# EAGLE design LipSync4_Main_Board_Alpha2 (EAGLE 9.6.2)
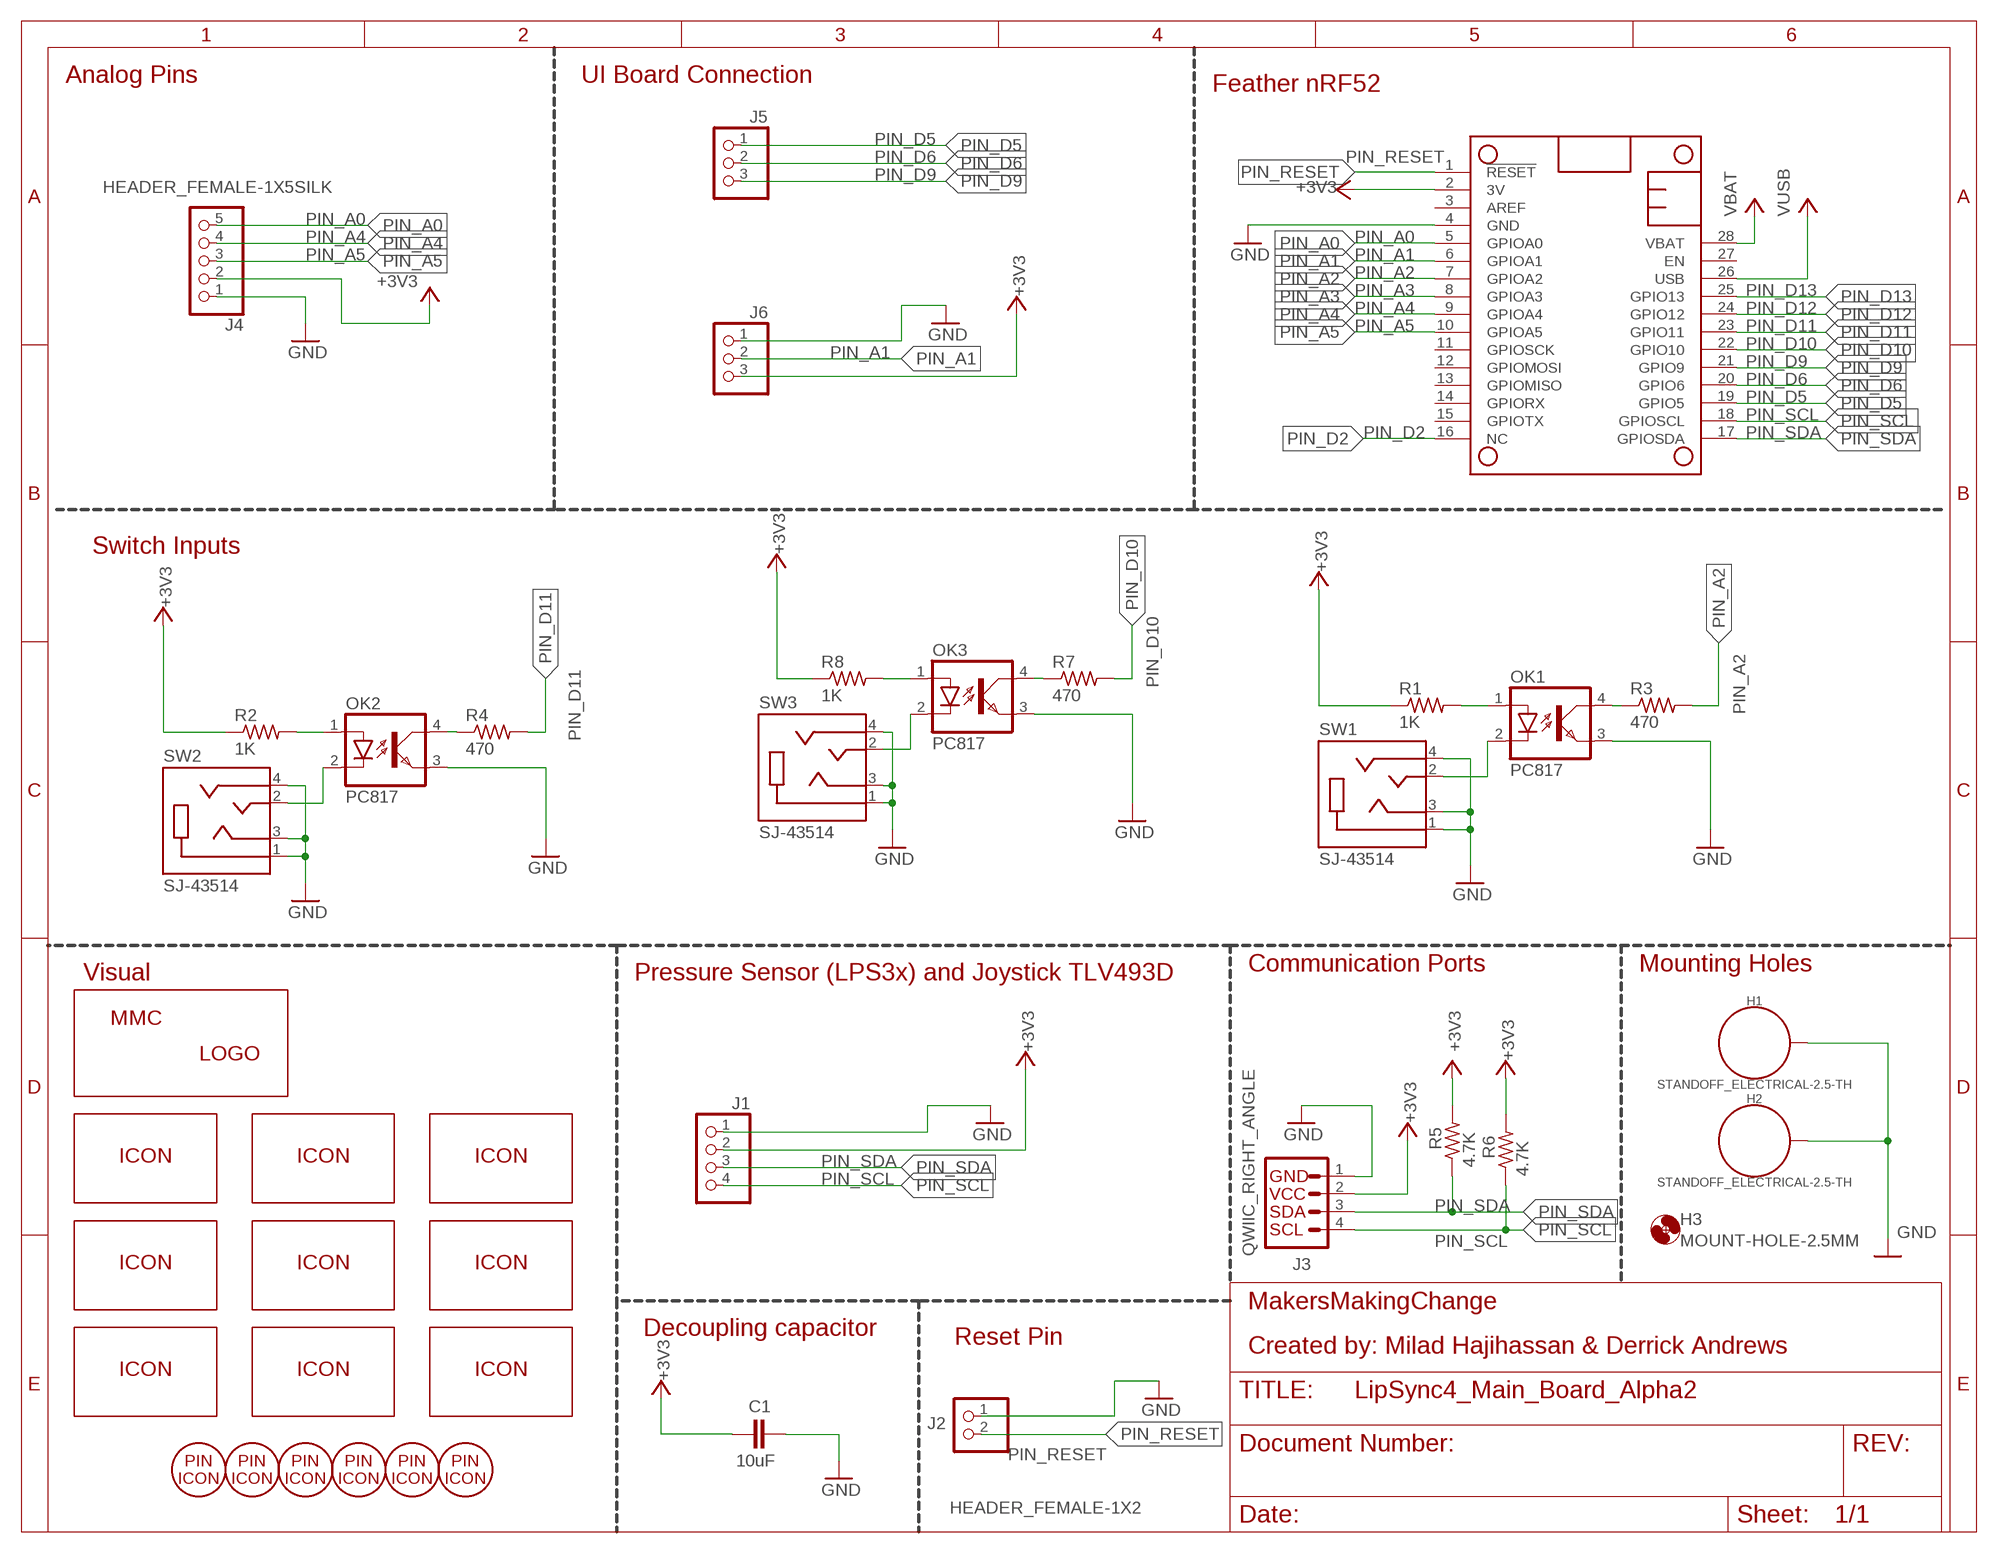
[diagram p0: schematic, sheet 1]

## Parts
C1  10uF  CAPACITOR-025-025X040  [CAP-025-025X040]
H1  STANDOFF_ELECTRICAL-2.5-TH  [STANDOFF-ELECTRICAL-2.5-TH]
H2  STANDOFF_ELECTRICAL-2.5-TH  [STANDOFF-ELECTRICAL-2.5-TH]
H3  MOUNT-HOLE-2.5MM  [HOLE-2.5MM]
J1  HEADER_FEMALE-1X4  [HEADER_FEMALE-1X04]
J2  HEADER_FEMALE-1X2  [HEADER_FEMALE-1X02]
J3  QWIIC_RIGHT_ANGLE  QWIIC_CONNECTORSJS-1MM  [CONNECTORS_JST04_1MM_RA]
J4  HEADER_FEMALE-1X5SILK  [HEADER_FEMALE-1X05_SILK]
J5  HEADER_MALE-1X03/270  [HEADER_MALE-1X03_LOCK/270]
J6  HEADER_MALE-1X03/270  [HEADER_MALE-1X03_LOCK/270]
LABE_BUTTON  MMC_ICON-BUTTON  [ICON_BUTTON]
LABE_LED  MMC_ICON-LED  [ICON_LED]
LABEL_ALPHA2  MMC_ICON-ALPHA2  [ICON_ALPHA2]
LABEL_I2C  MMC_ICON-I2C  [ICON_I2C]
LABEL_ICON_PIN1  MMC_PIN-ICON-PIN1  [PIN-ICON_1]
LABEL_ICON_PIN2  MMC_PIN-ICON-PIN2  [PIN-ICON_2]
LABEL_ICON_PIN3  MMC_PIN-ICON-PIN3  [PIN-ICON_3]
LABEL_ICON_PIN-DATA  MMC_PIN-ICON-DATA  [PIN-ICON_DATA]
LABEL_ICON_PIN-GND  MMC_PIN-ICON-GND  [PIN-ICON_GND]
LABEL_ICON_PIN-VCC  MMC_PIN-ICON-VCC  [PIN-ICON_VCC]
LABEL_LIPSYNC4  MMC_ICON-LIPSYNC4  [ICON_LIPSYNC4]
LABEL_MAIN-BOARD  MMC_ICON-MAIN-BOARD  [ICON_MAIN-BOARD]
LABEL_MMC  MMC_LOGO-SM  [MMC_SMALL_LOGO]
LABEL_RESET  MMC_ICON-RESET  [ICON_RESET]
LABEL_SPEAKER  MMC_ICON-SPEAKER  [ICON_SPEAKER]
LABEL_STEMMA  MMC_ICON-STEMMA  [ICON_STEMMA]
OK1  PC817  [DIL04]
OK2  PC817  [DIL04]
OK3  PC817  [DIL04]
R1  1K  RESISTOR-US-0204/5  [RESISTOR_0204/5]
R2  1K  RESISTOR-US-0204/5  [RESISTOR_0204/5]
R3  470  RESISTOR-US-0204/5  [RESISTOR_0204/5]
R4  470  RESISTOR-US-0204/5  [RESISTOR_0204/5]
R5  4.7K  RESISTOR-US-0204/5  [RESISTOR_0204/5]
R6  4.7K  RESISTOR-US-0204/5  [RESISTOR_0204/5]
R7  470  RESISTOR-US-0204/5  [RESISTOR_0204/5]
R8  1K  RESISTOR-US-0204/5  [RESISTOR_0204/5]
SW1  SJ-43514  [CUI_SJ-43514]
SW2  SJ-43514  [CUI_SJ-43514]
SW3  SJ-43514  [CUI_SJ-43514]
U1  ADAFRUIT_FEATHER_NODIM  [ADAFRUIT_FEATHERWING_DIM]

## Nets
+3V3: C1.2 J1.2 J3.2 J4.2 J6.3 R1.1 R2.1 R5.2 R6.2 R8.1 U1.2(3V)
GND: C1.1 H1.P1 H2.P1 J1.1 J2.1 J3.1 J4.1 J6.1 OK1.3(EMIT) OK2.3(EMIT) OK3.3(EMIT) SW1.1(SLEEVE) SW1.3(RING1) SW1.4(RING2) SW2.1(SLEEVE) SW2.3(RING1) SW2.4(RING2) SW3.1(SLEEVE) SW3.3(RING1) SW3.4(RING2) U1.4(GND)
N$1: OK3.1(A) R8.2
N$2: OK3.4(COL) R7.1
N$5: OK3.2(C) SW3.2(TIP)
N$7: OK2.1(A) R2.2
N$13: OK2.4(COL) R4.1
N$14: OK1.1(A) R1.2
N$16: OK2.2(C) SW2.2(TIP)
N$20: OK1.4(COL) R3.1
N$23: OK1.2(C) SW1.2(TIP)
PIN_A0: J4.5 U1.5(GPIOA0)
PIN_A1: J6.2 U1.6(GPIOA1)
PIN_A2: R3.2 U1.7(GPIOA2)
PIN_A3: U1.8(GPIOA3)
PIN_A4: J4.4 U1.9(GPIOA4)
PIN_A5: J4.3 U1.10(GPIOA5)
PIN_D2: U1.16(NC)
PIN_D5: J5.1 U1.19(GPIO5)
PIN_D6: J5.2 U1.20(GPIO6)
PIN_D9: J5.3 U1.21(GPIO9)
PIN_D10: R7.2 U1.22(GPIO10)
PIN_D11: R4.2 U1.23(GPIO11)
PIN_D12: U1.24(GPIO12)
PIN_D13: U1.25(GPIO13)
PIN_RESET: J2.2 U1.1(!RESET)
PIN_SCL: J1.4 J3.4 R6.1 U1.18(GPIOSCL)
PIN_SDA: J1.3 J3.3 R5.1 U1.17(GPIOSDA)
VBAT: U1.28(VBAT)
VUSB: U1.26(USB)
Unconnected: U1.3(AREF) U1.11(GPIOSCK) U1.12(GPIOMOSI) U1.13(GPIOMISO) U1.14(GPIORX) U1.15(GPIOTX) U1.27(EN)

## Notes on the sheet
- Analog Pins | UI Board Connection
- Feather nRF52
- Switch Inputs
- Communication Ports | Mounting Holes
- Visual | Pressure Sensor (LPS3x) and Joystick TLV493D
- MakersMakingChange
- Decoupling capacitor
- Reset Pin
- Created by: Milad Hajihassan & Derrick Andrews

## Library data of the parts
C1 = MMC Eagle:CAPACITOR-
H1 H2 = MMC Eagle:STANDOFF_ELECTRICAL: Stand Off Drill holes with an electrical connection. For example, use these to ground your board to a chassis. Example SparkFun Products Screw - Phillips Head (1/4", 4-40, 10 pack) <https://www.sparkfun.com/products/10453> (PRT-10453) Screw - Phillips Head (1/2", 4-40, 10 pack) <https://www.sparkfun.com/products/10452> (PRT-10452) Screw - Phillips Head (3/4", 4-40, 10 pack) <https://www.sparkfun.com/products/10451> (PRT-10451) Screw - Phillips Head (1", 4-40, 10 pack) <https://www.sparkfun.com/products/10450> (PRT-10450)
H3 = MMC Eagle:MOUNT-HOLE-: MOUNTING HOLE with drill center marker
J1 = MMC Eagle:HEADER_FEMALE-1X4: PIN HEADER
J2 = MMC Eagle:HEADER_FEMALE-1X2
J3 = MMC_SMD:QWIIC_CONNECTORS: SparkFun I2C Standard Qwiic Connector An SMD 1mm pitch JST connector makes it easy and quick (get it? Qwiic?) to connect I2C devices to each other. The Qwiic system <http://www.sparkfun.com/qwiic> enables fast and solderless connection between popular platforms and various sensors and actuators. We carry 200mm <https://www.sparkfun.com/products/14204>, 100mm <https://www.sparkfun.com/products/14205>, 50mm <https://www.sparkfun.com/products/14206>, and breadboard friendly <https://www.sparkfun.com/products/14207> Qwiic cables. We also offer 10 pcs strips <https://www.sparkfun.com/products/14323> the SMD connectors.; PROD_ID: CONN-13694
J4 = MMC Eagle:HEADER_FEMALE-1X5
J5 J6 = MMC Eagle:HEADER_MALE-1X03: Multi connection point. Often used as Generic Header-pin footprint for 0.1 inch spaced/style header connections On any of the 0.1 inch spaced packages, you can populate with these: Break Away Headers - Straight <https://www.sparkfun.com/products/116> (PRT-00116) Break Away Male Headers - Right Angle <https://www.sparkfun.com/products/553> (PRT-00553) Female Headers <https://www.sparkfun.com/products/115> (PRT-00115) Break Away Headers - Machine Pin <https://www.sparkfun.com/products/117> (PRT-00117) Break Away Female Headers - Swiss Machine Pin <https://www.sparkfun.com/products/743> (PRT-00743) Stackable Header - 3 Pin (Female, 0.1") <https://www.sparkfun.com/products/13875> (PRT-13875) For SCREWTERMINALS and SPRING TERMINALS visit here: Screw Terimnals on SparkFun.com <https://www.sparkfun.com/search/results?term=Screw+Terminals> (5mm/3.5mm/2.54mm spacing) This device is also useful as a general connection point to wire up your design to another part of your project. Our various solder wires solder well into these plated through hole pads. Hook-Up Wire - Assortment (Stranded, 22 AWG) <https://www.sparkfun.com/products/11375> (PRT-11375) Hook-Up Wire - Assortment (Solid Core, 22 AWG) <https://www.sparkfun.com/products/11367> (PRT-11367) View the entire wire category on our website here <https://www.sparkfun.com/categories/141> Special notes: Molex polarized connector foot print use with SKU : PRT-08232 with associated crimp pins and housings.
LABE_BUTTON LABE_LED LABEL_ALPHA2 LABEL_I2C LABEL_LIPSYNC4 LABEL_MAIN-BOARD LABEL_RESET LABEL_SPEAKER LABEL_STEMMA = MMC Eagle:MMC_ICON-
LABEL_ICON_PIN1-LABEL_ICON_PIN3 LABEL_ICON_PIN-DATA LABEL_ICON_PIN-GND LABEL_ICON_PIN-VCC = MMC Eagle:MMC_PIN-ICON-
LABEL_MMC = MMC Eagle:MMC_LOGO-
OK1-OK3 = MMC Eagle:PC817: SHARP OPTO COUPLER
R1-R8 = MMC Eagle:RESISTOR-US-: RESISTOR, American symbol
SW1-SW3 = MMC Eagle:SJ-43514: SJ-43514 3.50mm (0.141", 1/8", Mini Plug) - Headphone Phone Jack Stereo (4 Conductor, TRRS) Connector. You can use these as jacks to connect analog joysticks or create simple switch interfaces. Options: Digikey - CP-43514-ND <https://www.digikey.ca/en/products/detail/cui-devices/SJ-43514/368146> Mouser - 490-SJ-43514 <https://www.mouser.ca/ProductDetail/CUI-Devices/SJ-43514?qs=WyjlAZoYn51bsBOfuwwiuw%3D%3D>
U1 = MMC Eagle:ADAFRUIT_FEATHER: Adafruit Feather Feather is a flexible and powerful family of microcontroller main-boards (Feathers​) and daughter-boards (Wings) with a wide range of capabilities. Options: Adafruit - Adafruit Feather Boards <https://www.adafruit.com/category/830> Adafruit - Adafruit Feather Wings <https://www.adafruit.com/category/871>

## Board
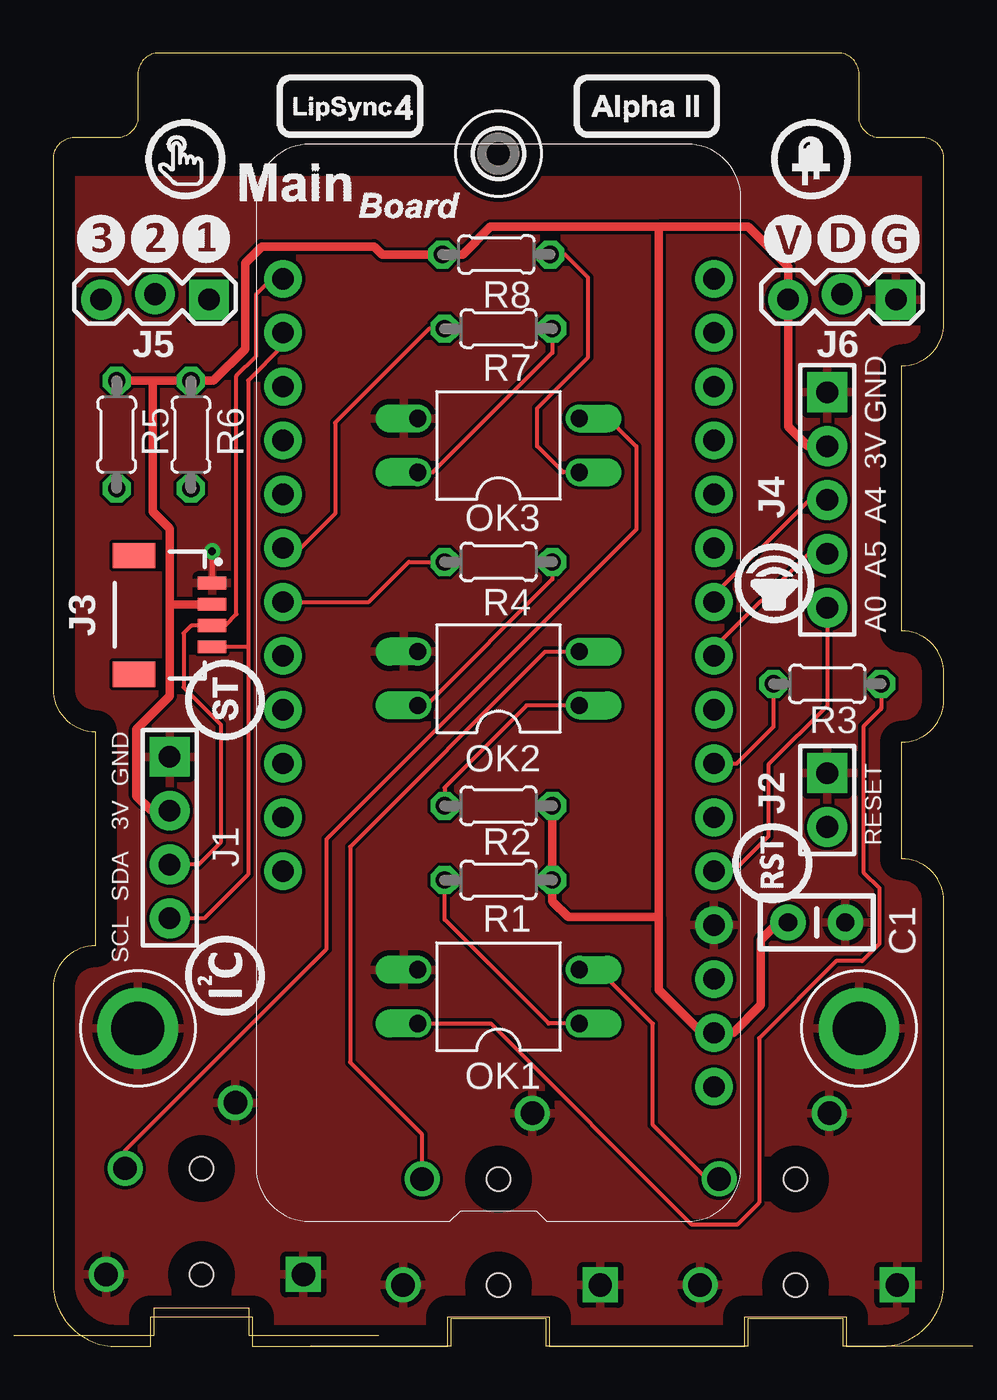
[diagram p1: board, top side]
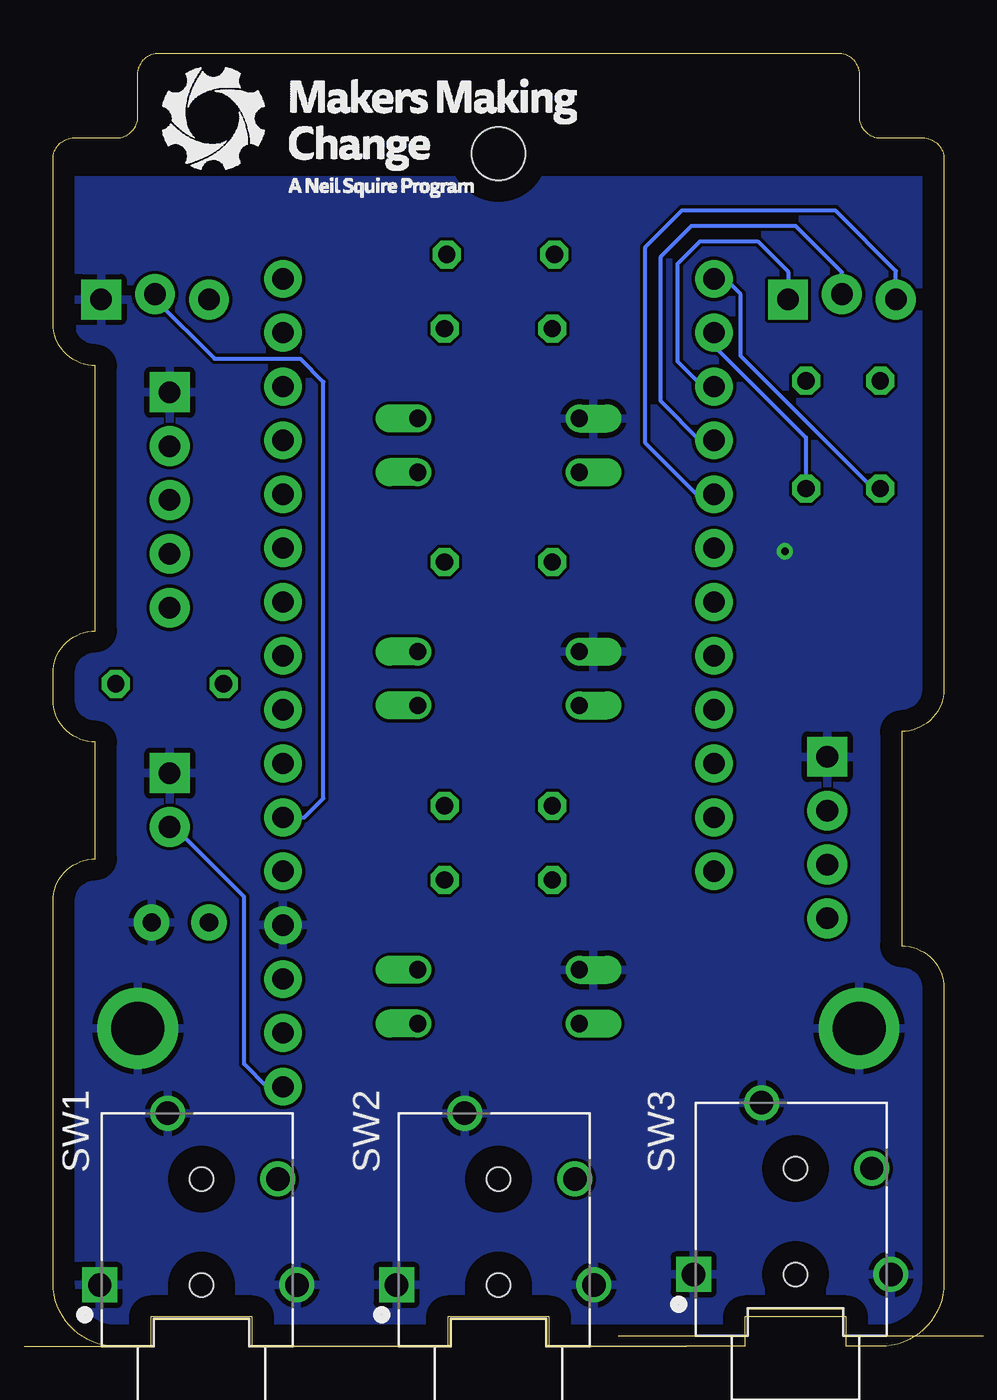
[diagram p2: board, bottom side, seen from below]

Size 42 x 61 mm. Coordinates in mm from the lower left corner, seen from the top.
Outline: 3,0 4.6,0 4.6,1.4 9.4,1.4 9.4,0 18.6,0 18.6,1.4 23.4,1.4 23.4,0 32.6,0 32.6,1.4 37.4,1.4 37.4,0 39,0 arc90 42,3 42,21 arc90 40,23 40,28.5 arc90 42,30.5 42,31.75 arc90 40,33.75 40,46.25 arc90 42,48.25 42,56 arc90 41,57 39,57 arc-90 38,58 38,60 arc90 37,61 5,61 arc90 4,60 4,58 arc-90 3,57 1,57 arc90 0,56 0,31 arc90 2,29 2,18.9 arc90 0,16.9 0,3 arc90 3,0
Copper layers (1*16): Top 0.035mm / dielectric 1.5mm / Bottom 0.035mm
Design rules "default": minimum track width 6mil, minimum drill 0.35mm, track to track 6mil, track to pad 6mil, pad to pad 6mil, via to via 6mil, smd to smd 6mil, copper to edge 40mil, drill to drill 6mil, minimum pad ring 10mil, minimum via ring 8mil, stop-mask expansion 4mil, vias tented up to drill 0mil, thermal gap 10mil

### Footprints (pad centres in the part's own frame; a part is rotated, then mirrored left to right if it is on the bottom)
CAP-025-025X040 = drill 0.864 pad 1.676: 1 -1.35,0; 2 1.35,0
STANDOFF-ELECTRICAL-2.5-TH = drill 2.5 pad 3.81: P1 0,0
HOLE-2.5MM = hole 2.5: 0,0
HEADER_FEMALE-1X04 = drill 1.016 pad 1.88 square: 1 -3.81,0 | drill 1.016 pad 1.88: 2 -1.27,0; 3 1.27,0; 4 3.81,0
HEADER_FEMALE-1X02 = drill 1.016 pad 1.88 square: 1 0,0 | drill 1.016 pad 1.88: 2 2.54,0
CONNECTORS_JST04_1MM_RA = smd 0.6 x 1.35: 1 -1.5,0; 2 -0.5,0; 3 0.5,0; 4 1.5,0 | smd 1.2 x 2: NC1 2.8,-3.675; NC2 -2.8,-3.675
HEADER_FEMALE-1X05_SILK = drill 1.016 pad 1.88 square: 1 0,0 | drill 1.016 pad 1.88: 2 2.54,0; 3 5.08,0; 4 7.62,0; 5 10.16,0
HEADER_MALE-1X03_LOCK/270 = drill 1.016 pad 1.88 square: 1 0,0.127 | drill 1.016 pad 1.88: 2 2.54,-0.127; 3 5.08,0.127
DIL04 = drill 0.813 offset: 1 -1.27,-3.81; 2 1.27,-3.81; 3 1.27,3.81; 4 -1.27,3.81
RESISTOR_0204/5 = drill 0.813 octagon: 1 -2.54,0; 2 2.54,0
CUI_SJ-43514 = drill 1.1 square: 1 -2.6,4.8 | drill 1.1: 2 2.4,-3.6; 3 5.5,1.6; 4 -2.6,-4.5 | hole 1.1: -2.6,0; 2.4,0
ADAFRUIT_FEATHERWING_DIM = drill 1 pad 1.778: 1 6.35,-10.16; 2 8.89,-10.16; 3 11.43,-10.16; 4 13.97,-10.16; 5 16.51,-10.16; 6 19.05,-10.16; 7 21.59,-10.16; 8 24.13,-10.16; 9 26.67,-10.16; 10 29.21,-10.16; 11 31.75,-10.16; 12 34.29,-10.16; 13 36.83,-10.16; 14 39.37,-10.16; 15 41.91,-10.16; 16 44.45,-10.16; 17 44.45,10.16; 18 41.91,10.16; 19 39.37,10.16; 20 36.83,10.16; 21 34.29,10.16; 22 31.75,10.16; 23 29.21,10.16; 24 26.67,10.16; 25 24.13,10.16; 26 21.59,10.16; 27 19.05,10.16; 28 16.51,10.16

### Placement (x,y rotation side)
C1  36,20 180 top
H1  4,15 90 top
H2  38,15 90 top
H3  21,56.25 0 top
J1  5.5,24 270 top
J2  36.5,27.04 270 top
J3  7.5,34.5 270 top
J4  36.5,45 270 top
J5  7.35,49.5 180 top
J6  39.73,49.5 180 top
LABE_BUTTON  6.25,56 0 top
LABE_LED  35.75,56 0 top
LABEL_ALPHA2  28,58.5 0 top
LABEL_I2C  8.1,17.5 90 top
LABEL_ICON_PIN1  7.24,52.25 0 top
LABEL_ICON_PIN2  4.81,52.25 0 top
LABEL_ICON_PIN3  2.27,52.25 0 top
LABEL_ICON_PIN-DATA  37.19,52.25 0 top
LABEL_ICON_PIN-GND  39.73,52.25 0 top
LABEL_ICON_PIN-VCC  34.65,52.25 0 top
LABEL_LIPSYNC4  14,58.5 0 top
LABEL_MAIN-BOARD  14,54.5 0 top
LABEL_MMC  25.8,57.25 0 bottom
LABEL_RESET  34,22.75 90 top
LABEL_SPEAKER  34,36 90 top
LABEL_STEMMA  8.1,30.5 90 top
OK1  21,16.5 90 top
OK2  21,31.5 90 top
OK3  21,42.5 90 top
R1  21,22 180 top
R2  21,25.5 180 top
R3  36.5,31.25 180 top
R4  21,37 180 top
R5  3,43 90 top
R6  6.5,43 90 top
R7  21,48 180 top
R8  20.9,51.5 0 top
SW1  35,5.5 90 bottom
SW2  21,5.5 90 bottom
SW3  7,6 90 bottom
U1  21,5.9 90 top

### Tracks (layer width: path | path; a pad name or v marks a point on that pad's centre or on a via)
+3V3
  Top 0.406: 28.55,20.25 28.55,16.82 30.57,14.79 U1.2 32.06,14.79 33.38,16.1 33.38,19.18 34.2,20 C1.2 | 28.55,20.25 24.29,20.25 23.54,21 R1.1 R2.1 | 28.55,52.8 20.61,52.8 19.31,51.5 R8.1 15.51,51.5 15.13,51.88 9.84,51.88 9.05,51.09 9.05,47.04 7.55,45.54 R6.2 4.69,45.54 | 28.55,20.25 28.55,52.8 | 4.69,45.54 R5.2 | 4.69,45.54 4.69,39.37 5.5,38.56 5.5,34.99 | J3.2 5.51,35 5.5,34.99 | J1.2 4.63,25.27 3.93,25.97 3.93,29.1 5.5,30.67 5.5,34.99 | J4.2 35.58,42.46 34.65,43.39 J6.3 34.65,50.94 32.78,52.8 28.55,52.8
GND  (via drill 0.35)
  Top 0.254: J3.1 v7.5,37.5
  pour Bottom: 3,0 39,0 arc90 42,3 42,55 0,55 0,3 arc90
  pour Top: 3,0 39,0 arc90 42,3 42,55 0,55 0,3 arc90
N$1
  Top 0.2: OK3.1 24.04,41.23 22.82,42.45 22.82,44.25 25.23,46.66 25.23,50.41 24.14,51.5 R8.2
N$2
  Top 0.2: R7.1 23.54,46.86 17.91,41.23 OK3.4
N$5
  Top 0.2: SW3.2 3.4,9.25 12.9,18.75 12.9,23.93 27.5,38.53 27.5,42.45 26.18,43.77 OK3.2
N$7
  Top 0.2: OK2.1 22.33,30.23 18.46,26.36 R2.2
N$13
  Top 0.2: R4.1 23.54,36.19 17.59,30.23 OK2.4
N$14
  Top 0.2: OK1.1 23.36,15.23 18.46,20.13 R1.2
N$16
  Top 0.2: SW2.2 17.4,10 14,13.4 14,23.57 23.2,32.77 OK2.2
N$20
  Top 0.2: OK1.4 20.64,15.23 30.1,5.77 32.27,5.77 33.28,6.78 33.28,14.54 36.92,18.18 38.14,18.18 38.95,18.99 38.95,21.61 38.2,22.36 38.2,29.23 39.03,30.06 39.04,30.12 R3.1
N$23
  Top 0.2: OK1.2 25.73,17.77 28.28,15.22 28.28,10.44 30.82,7.9 SW1.2
PIN_A0
  Top 0.2: J4.5 36.5,30.21 33.73,27.44 33.73,24.06 32.07,22.41 U1.5
PIN_A1
  Bottom 0.2: U1.6 30.16,24.95 29.26,25.85 29.26,45.49 30.35,46.58 34.39,46.58 37.19,49.38 J6.2
PIN_A2
  Top 0.2: U1.7 32.22,27.49 33.96,29.23 R3.2
PIN_A4
  Top 0.2: J4.4 35.61,37.38 31.16,32.93 U1.9
PIN_A5
  Top 0.2: U1.10 31.16,35.43 35.65,39.92 J4.3
PIN_D5
  Bottom 0.2: U1.19 11.37,45.27 12.55,46.45 12.55,51.05 11.49,52.12 8.79,52.12 7.35,50.68 J5.1
PIN_D6
  Bottom 0.2: U1.20 11.51,42.73 13.35,44.58 13.35,51.39 11.89,52.85 7,52.85 4.81,50.66 J5.2
PIN_D9
  Bottom 0.2: U1.21 11.67,40.19 14.08,42.6 14.08,51.84 12.34,53.58 5.13,53.58 2.27,50.72 J5.3
PIN_D10
  Top 0.2: R7.2 17.73,48 13.3,43.57 13.3,39.28 11.67,37.65 U1.22
PIN_D11
  Top 0.2: U1.23 14.89,35.11 16.78,37 R4.2
PIN_RESET
  Bottom 0.2: U1.1 31.92,12.25 32.99,13.32 32.99,21.19 36.3,24.5 J2.2
PIN_SCL
  Top 0.2: J3.4 9.19,33 | U1.18 10.84,47.2 9.19,45.56 9.19,33 | J1.4 7.12,20.19 9.19,22.26 9.19,33
  Bottom 0.2: U1.18 10.84,47.2 6.51,42.87 R6.1
PIN_SDA
  Top 0.2: U1.17 10.31,50.35 9.58,49.62 9.58,46.71 8.65,45.77 8.65,34.54 8.11,34 J3.3 6.52,34 6.16,33.64 6.16,31.08 7.9,29.34 7.9,23.76 6.87,22.73 J1.3
  Bottom 0.2: R5.1 3.33,40.46 9.58,46.71 9.58,49.62 10.31,50.35 U1.17

### Text on the board
tPlace: A0 A5 A4 3V GND | SCL SDA 3V GND | RESET